# Altium schematic sheet fpga_misc.SchDoc: MISC
size A4; Date: 2014/04/21; Author: fanhx; DrawnBy: fanhx
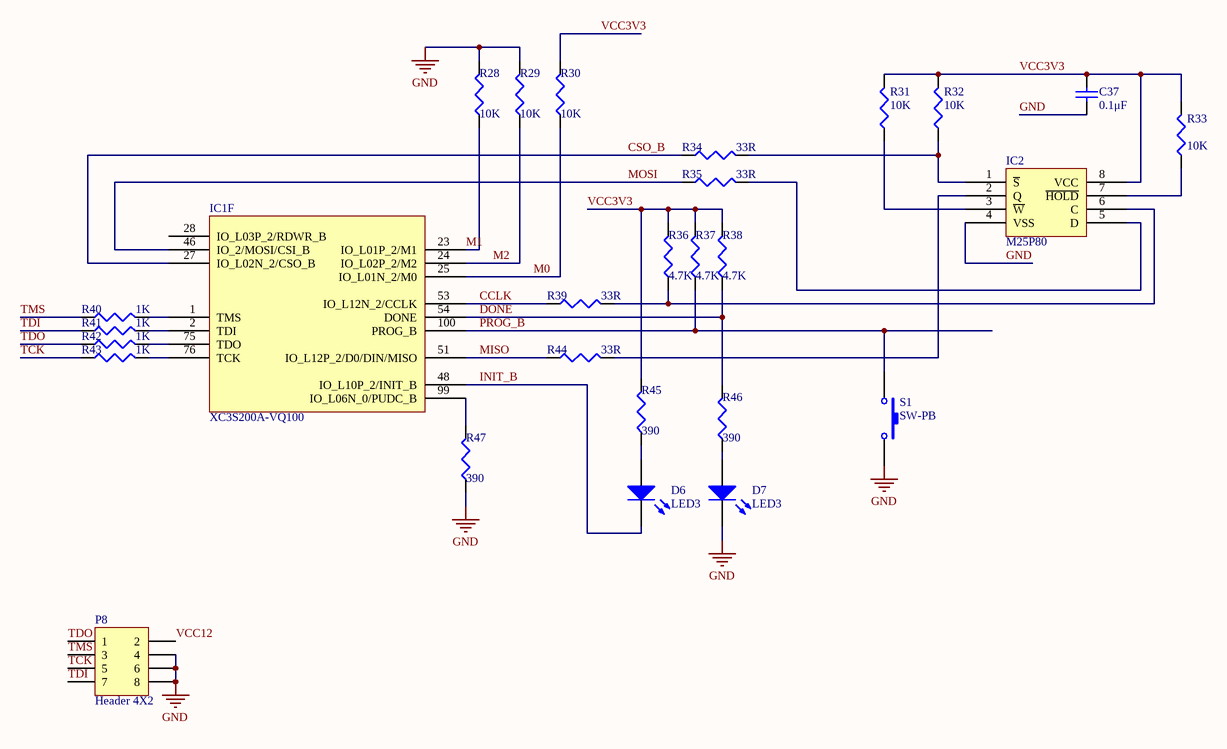
[diagram p0: fpga_misc.SchDoc]

## Parts
C37  value 0.1μF  [1608[0603]]  (hidden comment: Cap Semi)
D6  LED3  [LED0603]
D7  LED3  [LED0603]
IC1  XC3S200A-VQ100  [QFP50P1600X1600X120-100N]  (part F of 6)
IC2  M25P80  [SO8-WIDE8]
P8  Header 4X2  [HDR2X4]
R28  value 10K  [J1-0603]  (hidden comment: Res3)
R29  value 10K  [J1-0603]  (hidden comment: Res3)
R30  value 10K  [J1-0603]  (hidden comment: Res3)
R31  value 10K  [J1-0603]  (hidden comment: Res3)
R32  value 10K  [J1-0603]  (hidden comment: Res3)
R33  value 10K  [J1-0603]  (hidden comment: Res3)
R34  value 33R  [J1-0603]  (hidden comment: Res3)
R35  value 33R  [J1-0603]  (hidden comment: Res3)
R36  value 4.7K  [J1-0603]  (hidden comment: Res3)
R37  value 4.7K  [J1-0603]  (hidden comment: Res3)
R38  value 4.7K  [J1-0603]  (hidden comment: Res3)
R39  value 33R  [J1-0603]  (hidden comment: Res3)
R40  value 1K  [J1-0603]  (hidden comment: Res3)
R41  value 1K  [J1-0603]  (hidden comment: Res3)
R42  value 1K  [J1-0603]  (hidden comment: Res3)
R43  value 1K  [J1-0603]  (hidden comment: Res3)
R44  value 33R  [J1-0603]  (hidden comment: Res3)
R45  value 390  [J1-0603]  (hidden comment: Res3)
R46  value 390  [J1-0603]  (hidden comment: Res3)
R47  value 390  [J1-0603]  (hidden comment: Res3)
S1  SW-PB  [SPST-2]

## Nets
GND: C37.2 D7.2(K) IC2.4(VSS) P8.4 P8.6 P8.8 R28.2 R29.2 R47.1 S1.2
CCLK: IC1.53(IO_L12N_2/CCLK) R39.1
CSO_B: IC1.27(IO_L02N_2/CSO_B) R34.1
DONE: IC1.54(DONE) R38.1 R46.2
INIT_B: D6.2(K) IC1.48(IO_L10P_2/INIT_B)
M0: IC1.25(IO_L01N_2/M0) R30.1
M1: IC1.23(IO_L01P_2/M1) R28.1
M2: IC1.24(IO_L02P_2/M2) R29.1
MISO: IC1.51(IO_L12P_2/D0/DIN/MISO) R44.1
MOSI: IC1.46(IO_2/MOSI/CSI_B) R35.1
PROG_B: IC1.100(PROG_B) R37.1 S1.1
TCK: P8.5 R43.1
TDI: P8.7 R41.1
TDO: P8.1 R42.1
TMS: P8.3 R40.1
VCC3V3: C37.1 IC2.8(VCC) R30.2 R31.2 R32.2 R33.2 R36.2 R37.2 R38.2 R45.2
VCC12: P8.2
NetD6_1: D6.1(A) R45.1
NetD7_1: D7.1(A) R46.1
NetIC1_1: IC1.1(TMS) R40.2
NetIC1_2: IC1.2(TDI) R41.2
NetIC1_75: IC1.75(TDO) R42.2
NetIC1_76: IC1.76(TCK) R43.2
NetIC1_99: IC1.99(IO_L06N_0/PUDC_B) R47.2
NetIC2_1: IC2.1(~{S}) R32.1 R34.2
NetIC2_2: IC2.2(Q) R44.2
NetIC2_3: IC2.3(~{W}) R31.1
NetIC2_5: IC2.5(D) R35.2
NetIC2_6: IC2.6(C) R36.1 R39.2
NetIC2_7: IC2.7(~{HOLD}) R33.1

Not connected (* = marked no-connect by the designer): IC1 28(IO_L03P_2/RDWR_B)

## Library data of the parts
C37 = Cap Semi: Capacitor (Semiconductor SIM Model); Published: 8-Jun-2000; LatestRevisionDate: 29-May-2009; LatestRevisionNote: IPC-7351 Footprint Added.; PackageReference: C1206; Publisher: Altium Limited; PackageDescription: Chip Capacitor
D6 D7 = LED3: Typical BLUE SiC LED; Published: 8-Jun-2000; LatestRevisionDate: 17-Dec-2003; LatestRevisionNote: PCB Footprint replaced.; DatasheetVersion: 16-Apr-2002; PackageVersion: 16-Apr-2002; PackageReference: 3.5X2.8X1.9; Publisher: Altium Limited; PackageDescription: SM LED; 2 C-Bend Leads; Body 3.5 x 2.8 x 1.9 mm, inc leads (LxWxH typ)
P8 = Header 4X2: Header, 4-Pin, Dual row; LatestRevisionDate: 17-Jul-2002; LatestRevisionNote: Re-released for DXP Platform.; Publisher: Altium Limited
R28-R47 = Res3: Resistor; Published: 8-Jun-2000; LatestRevisionDate: 29-May-2009; LatestRevisionNote: IPC-7351 Footprint Added.; PackageReference: J1-0603; Publisher: Altium Limited; PackageDescription: Chip Resistor
S1 = SW-PB: Switch; Published: 24-Mar-1999; LatestRevisionDate: 17-Jul-2002; LatestRevisionNote: Re-released for DXP Platform.; PackageReference: SPST-2; Publisher: Altium Limited; PackageDescription: Switch; 2 Leads